# Altium schematic sheet SCH_ESP8266.SchDoc
size A3; SheetNumber: 7; SheetTotal: 10
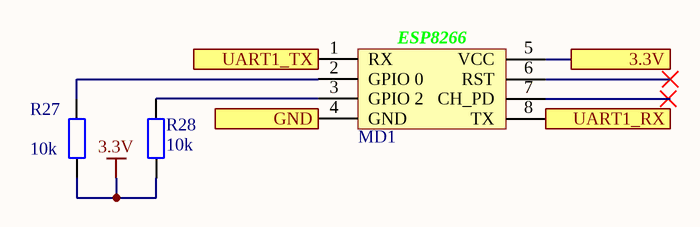
[diagram p0: SCH_ESP8266.SchDoc]

## Parts
MD1  ESP8266 Module  [ESP2866 Module]  (value not drawn)
R27  10k  [tro smd 0805]
R28  10k  [tro smd 0805]

## Ports
3.3V, GND, UART1_RX, UART1_TX

## Nets
3.3V: R27.1 R28.1
3.3V: MD1.5(VCC) ; port 3.3V  [a separate net that carries the same name]
GND: MD1.4(GND) ; port GND
UART1_RX: MD1.8(TX) ; port UART1_RX
UART1_TX: MD1.1(RX) ; port UART1_TX
NetMD1_2: MD1.2(GPIO_0) R27.2
NetMD1_3: MD1.3(GPIO_2) R28.2

Not connected (* = marked no-connect by the designer): MD1 6(RST)* 7(CH_PD)*

## Notes on the sheet
- (in symbol ESP8266 Module) ESP8266

## Library data of the parts
R27 R28 = Tro 0805 5% 10k: Dán; Don_Vi: Con; So_Chan: 2; Ten_Linh_Kien: Trở 0805 5% 10k; Ma_Hang: MH005239; Chung_Loai: Dán; Kieu_Chan: *